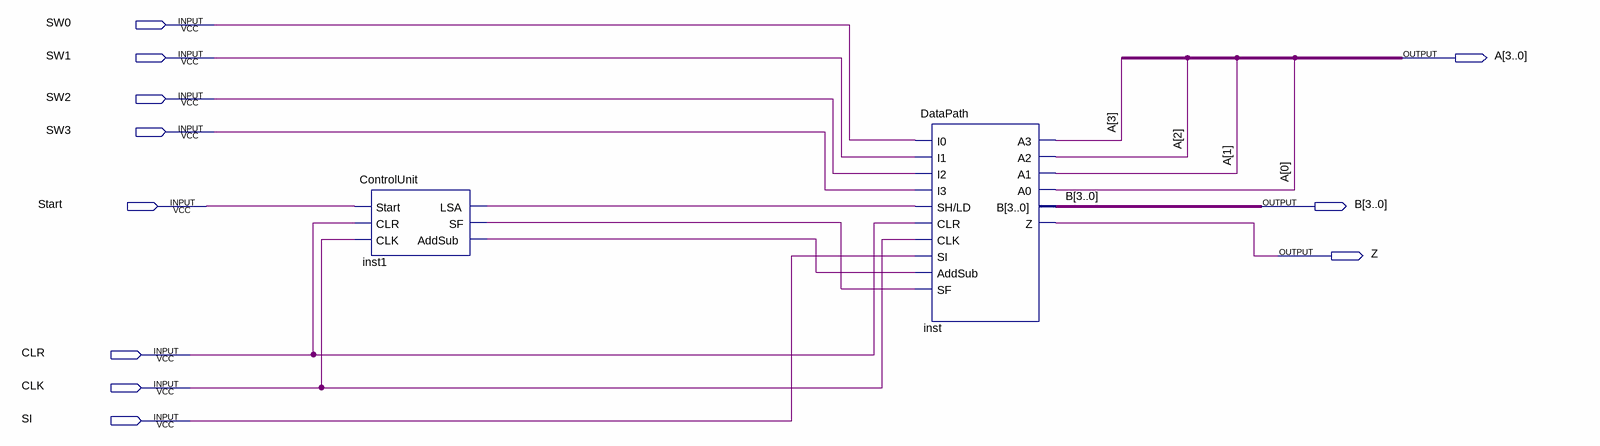
[diagram p0: schematic sheet]
// Quartus schematic AlgorithmicStateMachine.bdf as structural Verilog: 2 symbols, 11 pins
module AlgorithmicStateMachine (
  input  SW0,
  input  SW1,
  input  SW2,
  input  SW3,
  input  Start,
  input  CLR,
  input  CLK,
  input  SI,
  output [3:0] A,
  output [3:0] B,
  output Z
);

  wire inst1_addsub, inst1_lsa, inst1_sf;

  ControlUnit inst1 (.Start(Start), .CLR(CLR), .CLK(CLK), .LSA(inst1_lsa), .SF(inst1_sf), .AddSub(inst1_addsub));
  DataPath inst (
    .I0(SW0), .I1(SW1), .I2(SW2), .I3(SW3), .\SH/LD (inst1_lsa), .CLR(CLR), .CLK(CLK), .SI(SI),
    .AddSub(inst1_addsub), .SF(inst1_sf), .A3(A[3]), .A2(A[2]), .A1(A[1]), .A0(A[0]), .B(B), .Z(Z));
endmodule
